# EasyEDA schematic Mint - SCH_2025-02-01.json
TITLE: Sheet_1; REV: 1.0; Date: 2025-01-30; Sheet: 1/1; Drawn By: AtifIqbal; Company: Your Company
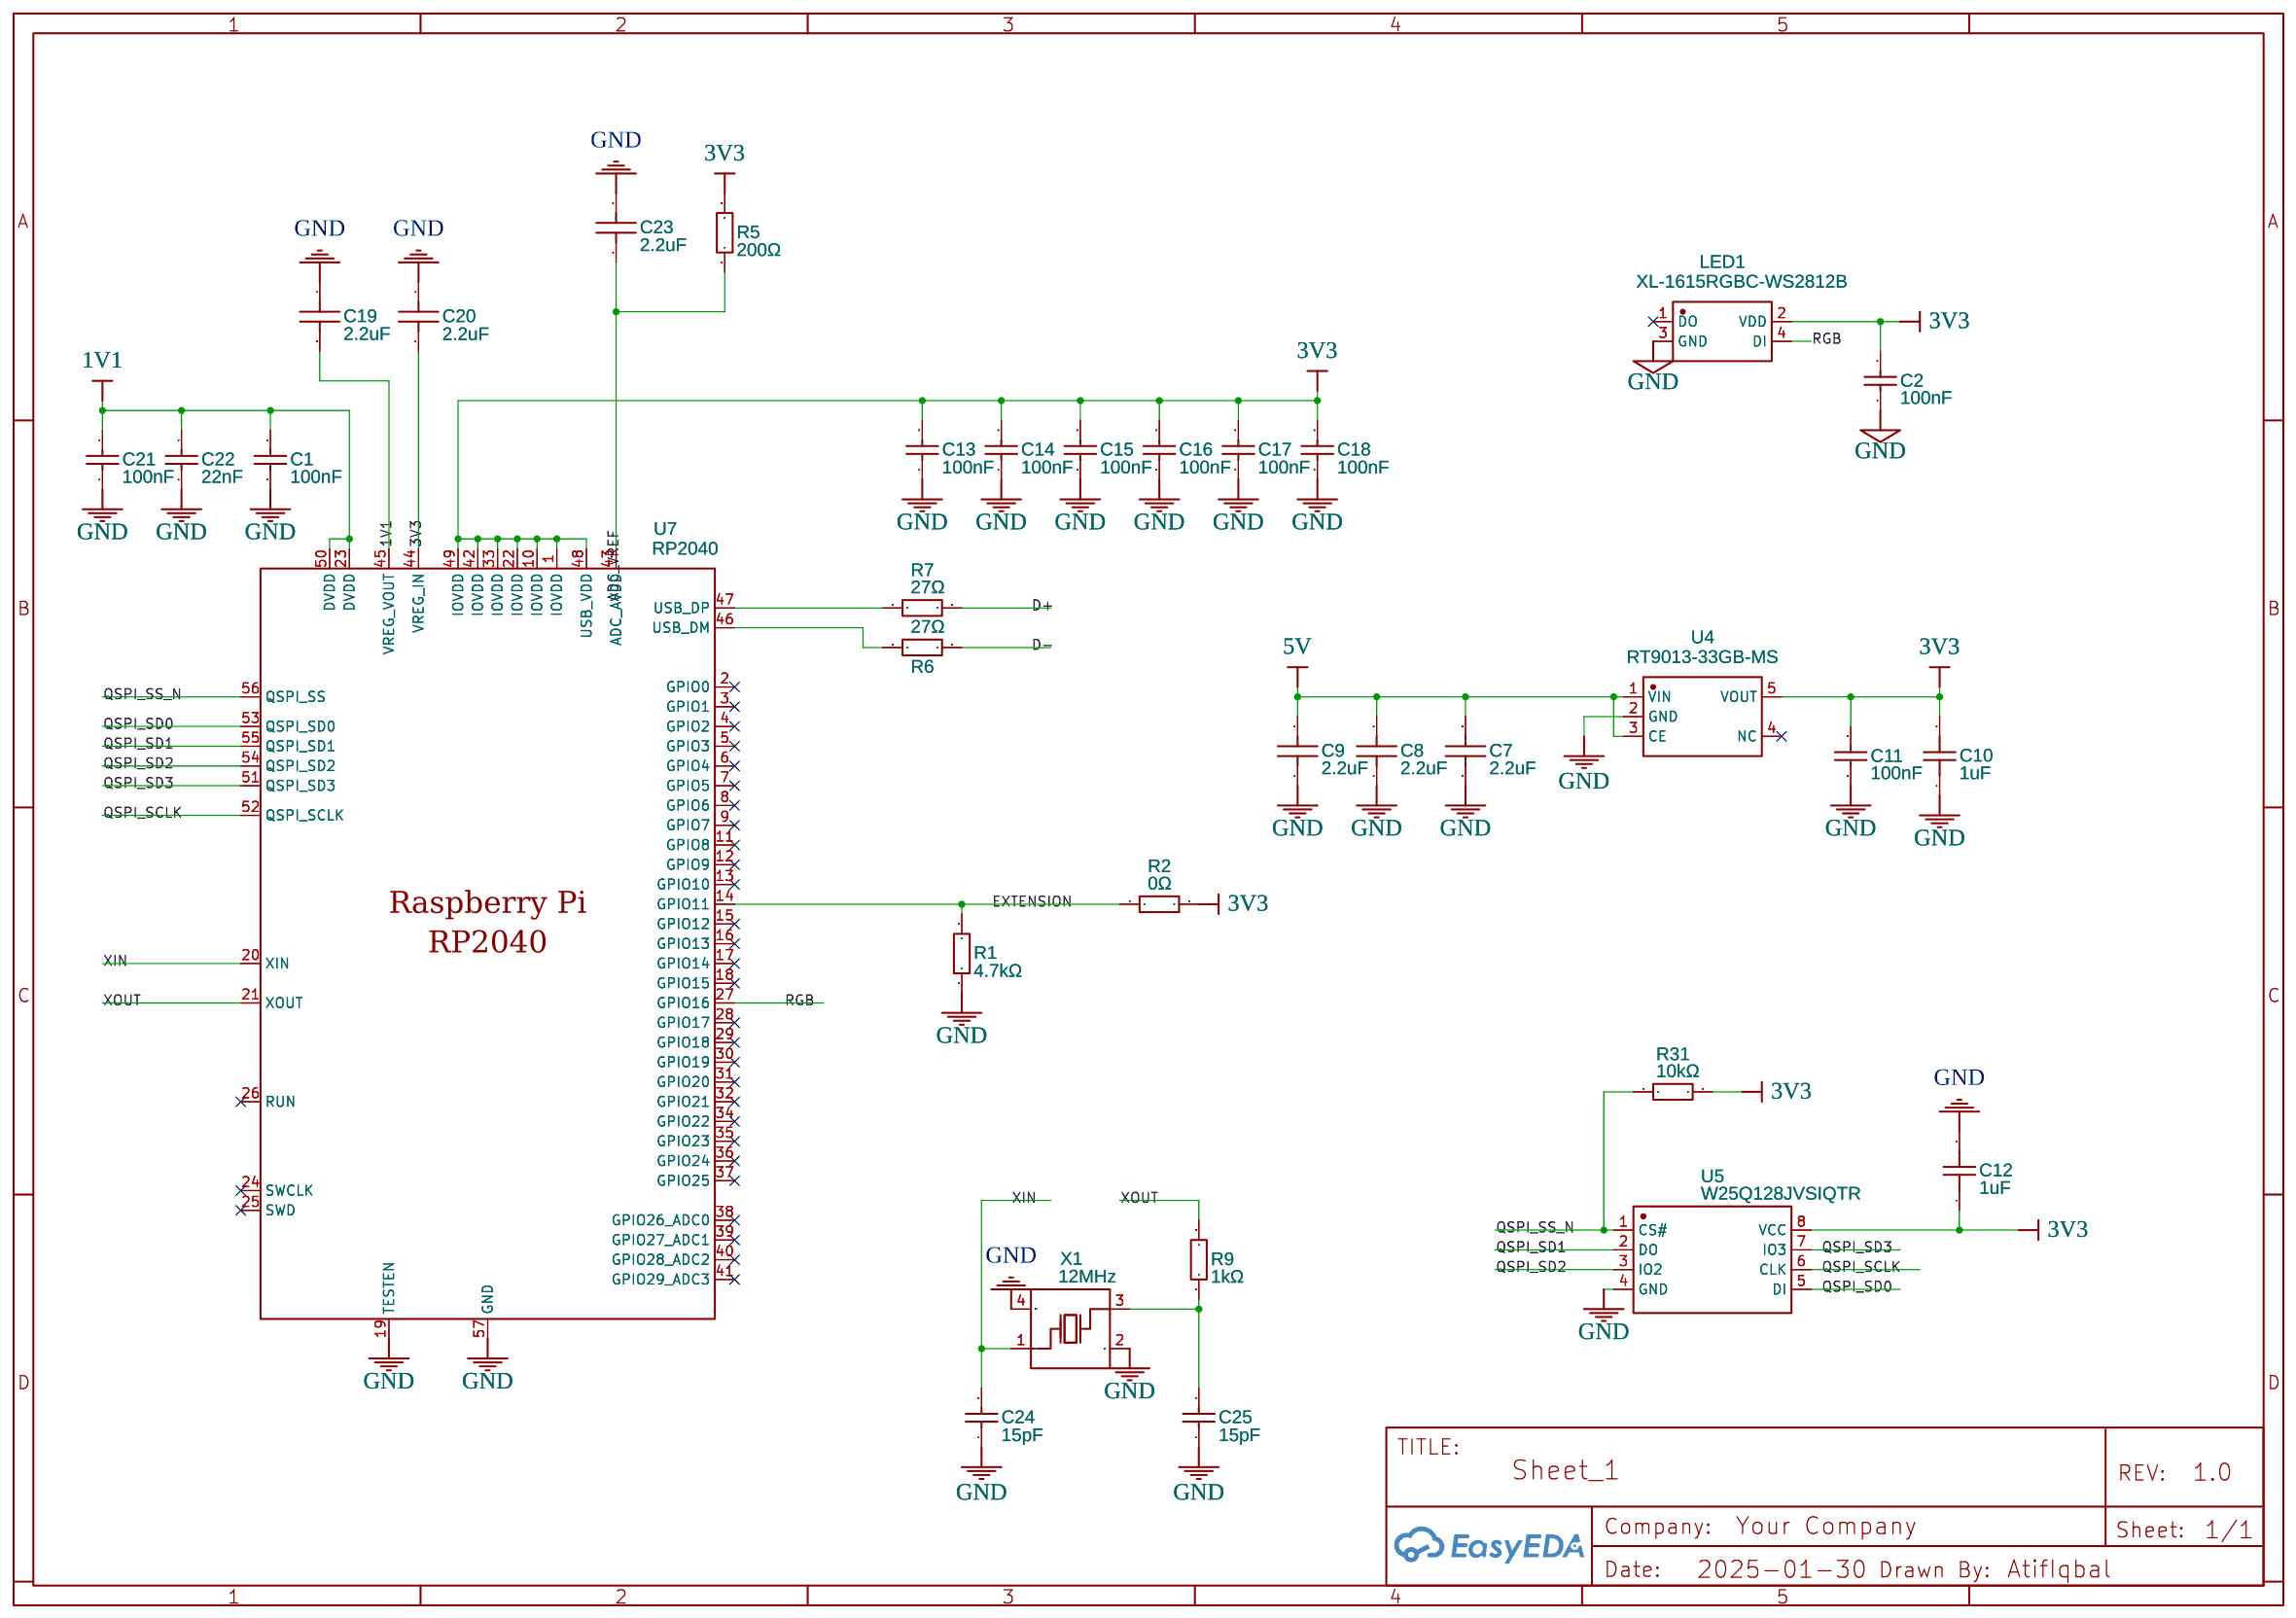
[diagram p0: schematic sheet]

## Parts
C1  100nF  [C0402]
C2  100nF  [C0402]
C7  2.2uF  [C0402]
C8  2.2uF  [C0402]
C9  2.2uF  [C0402]
C10  1uF  [C0402]
C11  100nF  [C0402]
C12  1uF  [C0402]
C13  100nF  [C0402]
C14  100nF  [C0402]
C15  100nF  [C0402]
C16  100nF  [C0402]
C17  100nF  [C0402]
C18  100nF  [C0402]
C19  2.2uF  [C0402]
C20  2.2uF  [C0402]
C21  100nF  [C0402]
C22  22nF  [C0402]
C23  2.2uF  [C0402]
C24  15pF  [C0402]
C25  15pF  [C0402]
LED1  XL-1615RGBC-WS2812B  [LED-SMD_4P-L1.6-W1.5_XL-1615RGBC-WS2812B]
R1  4.7kΩ  [R0402]
R2  0Ω  [R0402]
R5  200Ω  [R0402]
R6  27Ω  [R0402]
R7  27Ω  [R0402]
R9  1kΩ  [R0402]
R31  10kΩ  [R0402]
U4  RT9013-33GB-MS  [SOT-23-5_L2.9-W1.6-P0.95-LS2.8-BR]
U5  W25Q128JVSIQTR  [SOIC-8_L5.3-W5.3-P1.27-LS8.0-BL]
U7  RP2040  [LQFN-56_L7.0-W7.0-P0.4-EP]
X1  12MHz  [CRYSTAL-SMD_4P-L3.2-W2.5-BL]

## Library data of the parts
C1 C2 C11 C13-C18 C21 = CL05B104KO5NNNC: Supplier: LCSC; Manufacturer: SAMSUNG(三星); Supplier Part: C1525; JLCPCB Part Class: Basic Part
C7-C9 C19 C20 C23 = CL05A225MQ5NSNC: Supplier: LCSC; Manufacturer: SAMSUNG(三星); Supplier Part: C12530; JLCPCB Part Class: Basic Part
C10 C12 = CL05A105KA5NQNC: Supplier: LCSC; Manufacturer: SAMSUNG(三星); Supplier Part: C52923; JLCPCB Part Class: Basic Part
C22 = 0402B223K500NT: Supplier: LCSC; Manufacturer: FH(风华); Supplier Part: C1532; JLCPCB Part Class: Basic Part
C24 C25 = 0402CG150J500NT: Supplier: LCSC; Manufacturer: FH(风华); Supplier Part: C1548; JLCPCB Part Class: Basic Part
LED1 = XL-1615RGBC-WS2812B: Contributor: lcsc; Supplier: LCSC; Supplier Part: C5349954; Manufacturer: XINGLIGHT(成兴光); JLCPCB Part Class: Extended Part
R1 = 0402WGF4701TCE: Supplier: LCSC; Manufacturer: UNI-ROYAL(厚声); Supplier Part: C25900; JLCPCB Part Class: Basic Part
R2 = 0402WGF0000TCE: Supplier: LCSC; Manufacturer: UNI-ROYAL(厚声); Supplier Part: C17168; JLCPCB Part Class: Basic Part
R5 = 0402WGF2000TCE: Supplier: LCSC; Manufacturer: UNI-ROYAL(厚声); Supplier Part: C25087; JLCPCB Part Class: Basic Part
R6 R7 = 0402WGJ0270TCE: Supplier: LCSC; Manufacturer: UNI-ROYAL(厚声); Supplier Part: C25156; JLCPCB Part Class: Extended Part
R9 = 0402WGF1001TCE: Supplier: LCSC; Manufacturer: UNI-ROYAL(厚声); Supplier Part: C11702; JLCPCB Part Class: Basic Part
R31 = 0402WGF1002TCE: Supplier: LCSC; Manufacturer: UniOhm; Supplier Part: C25744; Resistance (Ohms): 10K; JLCPCB Part Class: Basic Part
U4 = RT9013-33GB-MS: Contributor: lcsc; Supplier: LCSC; Supplier Part: C7434207; Manufacturer: MSKSEMI(美森科); JLCPCB Part Class: Extended Part
U5 = W25Q128JVSIQTR: Supplier: LCSC; Manufacturer: WINBOND(华邦); Manufacturer Part: W25Q128JVSIQ; Supplier Part: C97521; JLCPCB Part Class: Basic Part
U7 = RP2040: Contributor: LCSC; Supplier: LCSC; Supplier Part: C2040; Manufacturer: Raspberry Pi(树莓派); JLCPCB Part Class: Extended Part
X1 = SMD-3225_4P12M12PF10PPM: Contributor: LCSC; Supplier: LCSC; Manufacturer: TAE(雅晶鑫); Supplier Part: C133337; JLCPCB Part Class: Extended Part

## Nets
1V1: C1.2 C19.2 C21.2 C22.1 U7.23(DVDD) U7.45(VREG_VOUT) U7.50(DVDD)
3V3: C2.2 C10.2 C11.2 C12.1 C13.2 C14.2 C15.2 C16.2 C17.2 C18.2 C20.2 LED1.2(VDD) R2.2 R5.2 R31.2 U4.5(VOUT) U5.8(VCC) U7.1(IOVDD) U7.10(IOVDD) U7.22(IOVDD) U7.33(IOVDD) U7.42(IOVDD) U7.44(VREG_IN) U7.48(USB_VDD) U7.49(IOVDD)
5V: C7.2 C8.2 C9.2 U4.1(VIN) U4.3(CE)
GND: C1.1 C2.1 C7.1 C8.1 C9.1 C10.1 C11.1 C12.2 C13.1 C14.1 C15.1 C16.1 C17.1 C18.1 C19.1 C20.1 C21.1 C22.2 C23.2 C24.1 C25.1 LED1.3(GND) R1.1 U4.2(GND) U5.4(GND) U7.19(TESTEN) U7.57(GND) X1.2(GND) X1.4(GND)
ADC_VREF: C23.1 R5.1 U7.43(ADC_AVDD)
D+: R7.2
D-: R6.2
EXTENSION: R1.2 R2.1 U7.14(GPIO11)
QSPI_SCLK: U5.6(CLK) U7.52(QSPI_SCLK)
QSPI_SD0: U5.5(DI) U7.53(QSPI_SD0)
QSPI_SD1: U5.2(DO) U7.55(QSPI_SD1)
QSPI_SD2: U5.3(IO2) U7.54(QSPI_SD2)
QSPI_SD3: U5.7(IO3) U7.51(QSPI_SD3)
QSPI_SS_N: R31.1 U5.1(CS#) U7.56(QSPI_SS)
RGB: LED1.4(DI) U7.27(GPIO16)
XIN: C24.2 U7.20(XIN) X1.1(OSC1)
XOUT: R9.2 U7.21(XOUT)
Net-(C25-2): C25.2 R9.1 X1.3(OSC2)
Net-(R6-1): R6.1 U7.46(USB_DM)
Net-(R7-1): R7.1 U7.47(USB_DP)

Not connected (* = marked no-connect by the designer): LED1 1(DO)*; U4 4(NC)*; U7 2(GPIO0)* 3(GPIO1)* 4(GPIO2)* 5(GPIO3)* 6(GPIO4)* 7(GPIO5)* 8(GPIO6)* 9(GPIO7)* 11(GPIO8)* 12(GPIO9)* 13(GPIO10)* 15(GPIO12)* 16(GPIO13)* 17(GPIO14)* 18(GPIO15)* 24(SWCLK)* 25(SWD)* 26(RUN)* 28(GPIO17)* 29(GPIO18)* 30(GPIO19)* 31(GPIO20)* 32(GPIO21)* 34(GPIO22)* 35(GPIO23)* 36(GPIO24)* 37(GPIO25)* 38(GPIO26_ADC0)* 39(GPIO27_ADC1)* 40(GPIO28_ADC2)* 41(GPIO29_ADC3)*
